# Altium schematic sheet Sheet1.SchDoc
size A4; SheetNumber: 1; SheetTotal: 1
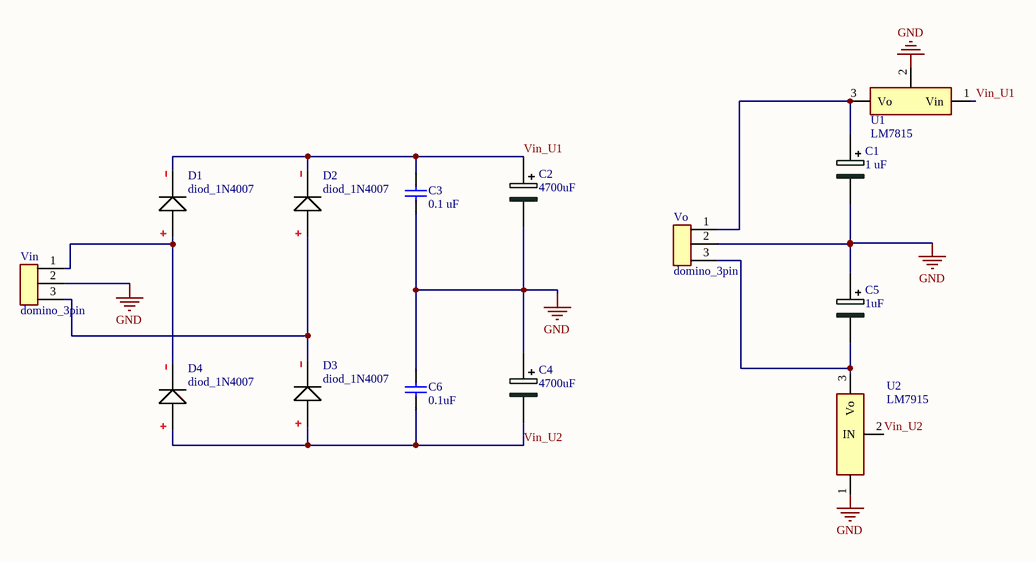
[diagram p0: Sheet1.SchDoc]

## Parts
C1  1 uF  [capacitor_elec_t/h_5mm]
C2  4700uF  [capacitor_elec_t/h_5mm]
C3  0.1 uF  [tu gom]
C4  4700uF  [capacitor_elec_t/h_5mm]
C5  1uF  [capacitor_elec_t/h_5mm]
C6  0.1uF  [tu gom]
D1  diod_1N4007  [diode_t/h_1N4007]
D2  diod_1N4007  [diode_t/h_1N4007]
D3  diod_1N4007  [diode_t/h_1N4007]
D4  diod_1N4007  [diode_t/h_1N4007]
U1  LM7815  [LM7812]
U2  LM7915  [LM7915]
Vin  domino_3pin  [domino_3pin_5.08mm]
Vo  domino_3pin  [domino_3pin_5.08mm]

## Nets
GND: C1.2 C2.2 C3.2 C4.1 C5.1 C6.2 U1.2(GND) U2.1(GND) Vin.2 Vo.2
Vin_U1: C2.1 C3.1 D1.2(K) D2.2(K) U1.1(Vin)
Vin_U2: C4.2 C6.1 D3.1(A) D4.1(A) U2.2(IN)
NetC1_1: C1.1 U1.3(Vo) Vo.1
NetC5_2: C5.2 U2.3(Vo) Vo.3
NetD1_1: D1.1(A) D4.2(K) Vin.1
NetD2_1: D2.1(A) D3.2(K) Vin.3

## Library data of the parts
C1 C2 C4 C5 = capacitor_electric
C3 C6 = Tu gom 223 50V: Cắm; Don_Vi: Con; So_Chan: 2; Ten_Linh_Kien: Tụ gốm 223-22nF 50V; Ma_Hang: MH007018; Chung_Loai: Cắm; Kieu_Chan: *
U1 = LM7812